# EAGLE design 5x_SFH_Hoeller_ES (EAGLE 9.2.2)
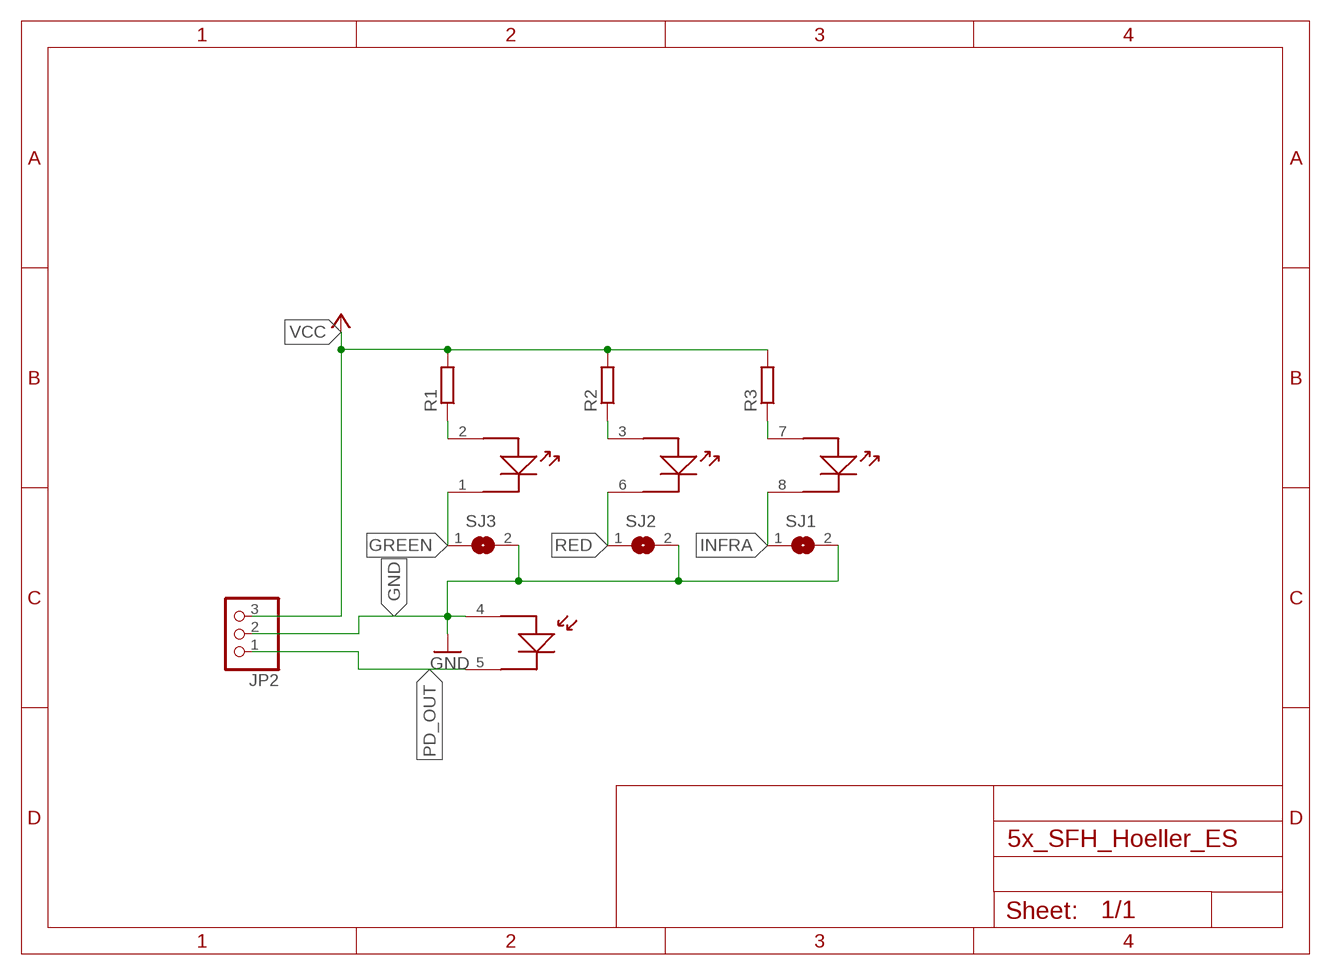
[diagram p0: schematic, sheet 1]

## Parts
JP2  PINHD-1X3  [1X03]
PD-  SFH7050_SFH7050  [SFH7050_SFH7050]
R1  R-EU_R0603  [R0603]
R2  R-EU_R0603  [R0603]
R3  R-EU_R0603  [R0603]
SJ1  SJ  [SJ]
SJ2  SJ  [SJ]
SJ3  SJ  [SJ]

## Nets
GND: JP2.2 PD-.4(A) SJ1.2 SJ2.2 SJ3.2
GREEN: PD-.1(C) SJ3.1
INFRA: PD-.8(C) SJ1.1
N$12: PD-.2(A) R1.1
N$13: PD-.3(A) R2.1
N$14: PD-.7(A) R3.1
PD_OUT: JP2.1 PD-.5(C)
RED: PD-.6(C) SJ2.1
VCC: JP2.3 R1.2 R2.2 R3.2

## Library data of the parts
JP2 = pinhead:PINHD-1X3: PIN HEADER
PD- = 170124_SFH7050_radial_long:SFH7050_SFH7050
R1-R3 = rcl:R-EU_: RESISTOR, European symbol; SPICEPREFIX: R
SJ1-SJ3 = jumper:SJ: SMD solder JUMPER

## Board
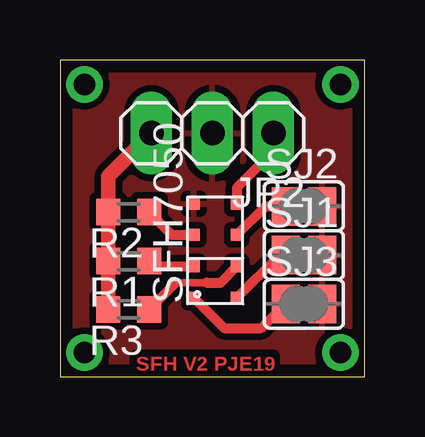
[diagram p1: board, top side]

Size 12.7 x 13.21 mm. Coordinates in mm from the lower left corner, seen from the top.
Outline: 0,0 12.7,0 12.7,13.21 0,13.21 0,0
Copper layers (1*16): Top 0.035mm / dielectric 1.5mm / Bottom 0.035mm
Design rules "EMSP_SMD_DRC_2019": minimum track width 13mil, minimum drill 0.6mm, track to track 11mil, track to pad 0.25mm, pad to pad 0.25mm, via to via 11mil, smd to smd 8mil, copper to edge 20mil, drill to drill 16mil, minimum pad ring 12mil, minimum via ring 12mil, stop-mask expansion 4mil, vias tented up to drill 0mil, thermal gap 12mil

### Footprints (pad centres in the part's own frame; a part is rotated, then mirrored left to right if it is on the bottom)
1X03 = drill 1.016 long: 1 -2.54,0; 2 0,0; 3 2.54,0
SFH7050_SFH7050 = smd 0.5 x 0.5: 1 0.25,2.05; 2 1.56,2.05; 3 2.87,2.05; 4 4.18,2.05; 5 4.18,0.25; 6 2.87,0.25; 7 1.56,0.25; 8 0.25,0.25
R0603 = smd 1 x 1.1: 1 -0.85,0; 2 0.85,0
SJ = smd 1.168 x 1.6: 1 -0.762,0; 2 0.762,0

### Placement (x,y rotation side)
JP2  6.35,10.16 180 top
PD-  7.62,3.05 90 top
R1  2.86,4.83 180 top
R2  2.86,6.87 180 top
R3  2.86,2.81 180 top
SJ1  10.16,5.08 0 top
SJ2  10.16,7.11 0 top
SJ3  10.16,3.05 0 top

### Tracks (layer width: path | path; a pad name or v marks a point on that pad's centre or on a via)
GND
  pour Top: 0,13.21 12.7,13.21 12.7,0 0,0
GREEN
  Top 0.406: PD-.1 6.84,2.03 8.38,2.03 SJ3.1
INFRA
  Top 0.406: PD-.8 9.15,5.08 SJ1.1
N$6  (via drill 0.9 pad 0.9)
  other vias: 1.02,1.02
N$7  (via drill 0.9 pad 0.9)
  other vias: 11.68,1.02
N$8  (via drill 0.9 pad 0.9)
  other vias: 1.02,12.19
N$9  (via drill 0.9 pad 0.9)
  other vias: 11.68,12.19
N$12
  Top 0.406: R1.1 3.93,4.61 PD-.2
N$13
  Top 0.406: R2.1 4.66,5.92 PD-.3
N$14
  Top 0.305: 4.71,3.81 4.83,3.94 6.1,3.94
  Top 0.406: PD-.7 6.7,3.94 6.1,3.94 | R3.1 4.71,3.81
PD_OUT
  Top 0.406: JP2.1 8.89,9.4 7.37,7.88 PD-.5
RED
  Top 0.406: PD-.6 8.56,7.11 SJ2.1
VCC
  Top 0.61: JP2.3 2.01,8.36 R2.2 R1.2 R3.2

### Text on the board
Top: SFH V2 PJE19